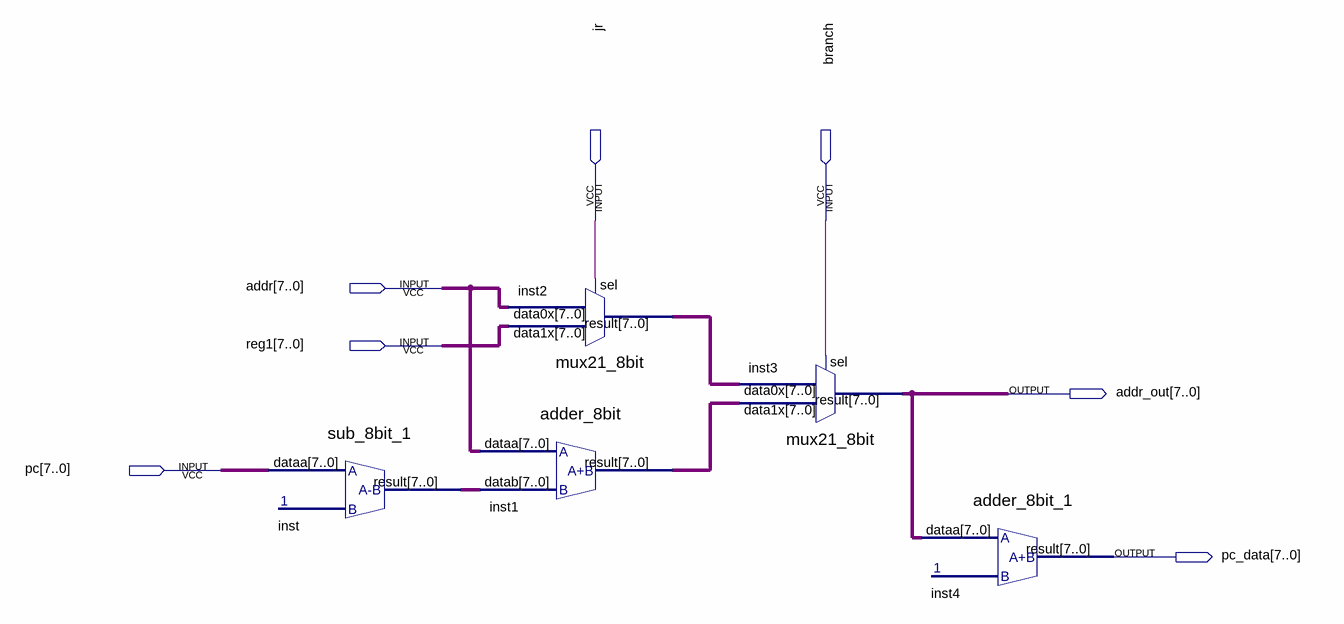
[diagram p0: schematic sheet]
// Quartus schematic jump_sel_8.bdf as structural Verilog: 5 symbols, 7 pins
module jump_sel_8 (
  input  jr,
  input  branch,
  input  [7:0] addr,
  input  [7:0] reg1,
  input  [7:0] pc,
  output [7:0] addr_out,
  output [7:0] pc_data
);

  wire [7:0] inst1_result, inst2_result, inst_result;

  sub_8bit_1 inst (.dataa(pc), .result(inst_result));
  mux21_8bit inst2 (.data1x(reg1), .data0x(addr), .sel(jr), .result(inst2_result));
  adder_8bit inst1 (.dataa(addr), .datab(inst_result), .result(inst1_result));
  mux21_8bit inst3 (.data1x(inst1_result), .data0x(inst2_result), .sel(branch), .result(addr_out));
  adder_8bit_1 inst4 (.dataa(addr_out), .result(pc_data));
endmodule
